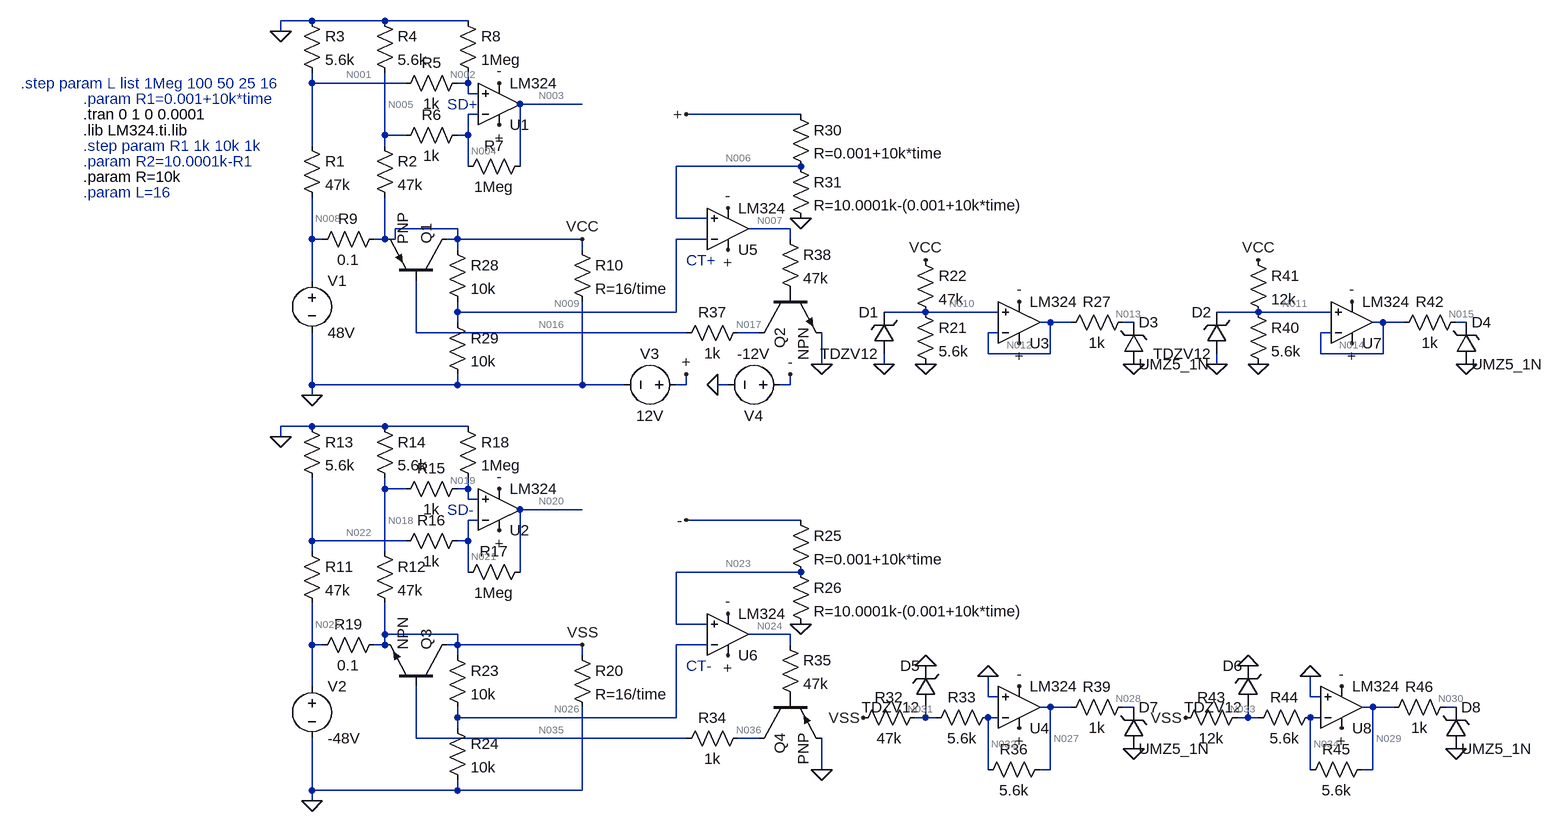
[diagram p0: schematic PSU_digital.asc]
PSU_digital.asc, the LTspice schematic file:
Version 4
SHEET 1 1804 1104
WIRE -96 -144 -144 -144
WIRE 16 -144 -96 -144
WIRE 144 -144 16 -144
WIRE -144 -128 -144 -144
WIRE -96 -48 -96 -64
WIRE 48 -48 -96 -48
WIRE 144 -48 144 -64
WIRE 144 -48 128 -48
WIRE 144 -32 144 -48
WIRE 160 -32 144 -32
WIRE 320 -16 224 -16
WIRE 160 0 144 0
WIRE 656 0 480 0
WIRE 16 32 16 -64
WIRE 48 32 16 32
WIRE 144 32 144 0
WIRE 144 32 128 32
WIRE -96 48 -96 -48
WIRE 16 48 16 32
WIRE 144 80 144 32
WIRE 224 80 224 -16
WIRE 656 80 464 80
WIRE 464 160 464 80
WIRE 512 160 464 160
WIRE 128 176 32 176
WIRE 640 176 576 176
WIRE -96 192 -96 128
WIRE -80 192 -96 192
WIRE 16 192 16 128
WIRE 16 192 0 192
WIRE 32 192 32 176
WIRE 32 192 16 192
WIRE 128 192 128 176
WIRE 128 192 112 192
WIRE 320 192 128 192
WIRE 512 192 464 192
WIRE 640 192 640 176
WIRE 128 208 128 192
WIRE 320 208 320 192
WIRE -96 256 -96 192
WIRE 128 304 128 288
WIRE 464 304 464 192
WIRE 464 304 128 304
WIRE 848 304 784 304
WIRE 960 304 848 304
WIRE 1360 304 1296 304
WIRE 1472 304 1360 304
WIRE 128 320 128 304
WIRE 1040 320 1024 320
WIRE 1072 320 1040 320
WIRE 1168 320 1152 320
WIRE 1552 320 1536 320
WIRE 1584 320 1552 320
WIRE 1680 320 1664 320
WIRE 64 336 64 256
WIRE 480 336 64 336
WIRE 592 336 560 336
WIRE 960 336 944 336
WIRE 1472 336 1456 336
WIRE 944 368 944 336
WIRE 1040 368 1040 320
WIRE 1040 368 944 368
WIRE 1456 368 1456 336
WIRE 1552 368 1552 320
WIRE 1552 368 1456 368
WIRE 688 384 688 336
WIRE 784 384 784 368
WIRE 1296 384 1296 368
WIRE -96 416 -96 336
WIRE 128 416 128 400
WIRE 128 416 -96 416
WIRE 320 416 320 288
WIRE 320 416 128 416
WIRE 384 416 320 416
WIRE 480 416 480 400
WIRE 480 416 464 416
WIRE 544 416 528 416
WIRE 640 416 640 400
WIRE 640 416 624 416
WIRE -96 432 -96 416
WIRE -96 480 -144 480
WIRE 16 480 -96 480
WIRE 144 480 16 480
WIRE -144 496 -144 480
WIRE 16 576 16 560
WIRE 48 576 16 576
WIRE 144 576 144 560
WIRE 144 576 128 576
WIRE 144 592 144 576
WIRE 160 592 144 592
WIRE 320 608 224 608
WIRE 160 624 144 624
WIRE 656 624 480 624
WIRE -96 656 -96 560
WIRE 48 656 -96 656
WIRE 144 656 144 624
WIRE 144 656 128 656
WIRE -96 672 -96 656
WIRE 16 672 16 576
WIRE 144 704 144 656
WIRE 224 704 224 608
WIRE 656 704 464 704
WIRE 464 784 464 704
WIRE 512 784 464 784
WIRE 16 800 16 752
WIRE 128 800 16 800
WIRE 640 800 576 800
WIRE -96 816 -96 752
WIRE -80 816 -96 816
WIRE 16 816 16 800
WIRE 16 816 0 816
WIRE 128 816 128 800
WIRE 128 816 112 816
WIRE 320 816 128 816
WIRE 512 816 464 816
WIRE 640 816 640 800
WIRE 128 832 128 816
WIRE 320 832 320 816
WIRE -96 880 -96 816
WIRE 944 896 944 864
WIRE 960 896 944 896
WIRE 1440 896 1440 864
WIRE 1456 896 1440 896
WIRE 1040 912 1024 912
WIRE 1072 912 1040 912
WIRE 1168 912 1152 912
WIRE 1536 912 1520 912
WIRE 1568 912 1536 912
WIRE 1664 912 1648 912
WIRE 128 928 128 912
WIRE 464 928 464 816
WIRE 464 928 128 928
WIRE 848 928 848 912
WIRE 848 928 832 928
WIRE 864 928 848 928
WIRE 960 928 944 928
WIRE 1344 928 1344 912
WIRE 1344 928 1328 928
WIRE 1360 928 1344 928
WIRE 1456 928 1440 928
WIRE 128 944 128 928
WIRE 64 960 64 880
WIRE 480 960 64 960
WIRE 592 960 560 960
WIRE 688 1008 688 960
WIRE 944 1008 944 928
WIRE 1040 1008 1040 912
WIRE 1040 1008 1024 1008
WIRE 1440 1008 1440 928
WIRE 1536 1008 1536 912
WIRE 1536 1008 1520 1008
WIRE -96 1040 -96 960
WIRE 128 1040 128 1024
WIRE 128 1040 -96 1040
WIRE 320 1040 320 912
WIRE 320 1040 128 1040
WIRE -96 1056 -96 1040
FLAG -144 -128 0
FLAG -96 432 0
FLAG 480 400 +
FLAG 544 208 +
FLAG 656 160 0
FLAG 192 16 +
FLAG 688 384 0
FLAG 640 400 -
FLAG 528 416 0
FLAG -144 496 0
FLAG -96 1056 0
FLAG 656 784 0
FLAG 688 1008 0
FLAG 192 576 -
FLAG 544 768 -
FLAG 192 640 +
FLAG 192 -48 -
FLAG 544 832 +
FLAG 544 144 -
FLAG 480 0 +
FLAG 480 624 -
FLAG 320 192 VCC
FLAG 320 816 VSS
FLAG 992 352 +
FLAG 992 288 -
FLAG 848 224 VCC
FLAG 848 384 0
FLAG 944 864 0
FLAG 992 880 -
FLAG 992 944 +
FLAG 752 928 VSS
FLAG 1504 352 +
FLAG 1504 288 -
FLAG 1360 224 VCC
FLAG 1360 384 0
FLAG 1440 864 0
FLAG 1488 880 -
FLAG 1488 944 +
FLAG 1248 928 VSS
FLAG 784 384 0
FLAG 1296 384 0
FLAG 1168 384 0
FLAG 1680 384 0
FLAG 848 848 0
FLAG 1344 848 0
FLAG 1168 976 0
FLAG 1664 976 0
SYMBOL res -112 32 R0
SYMATTR InstName R1
SYMATTR Value 47k
SYMBOL res 0 32 R0
SYMATTR InstName R2
SYMATTR Value 47k
SYMBOL res -112 -160 R0
SYMATTR InstName R3
SYMATTR Value 5.6k
SYMBOL res 0 -160 R0
SYMATTR InstName R4
SYMATTR Value 5.6k
SYMBOL res 144 -64 R90
WINDOW 0 0 56 VBottom 2
WINDOW 3 32 56 VTop 2
SYMATTR InstName R5
SYMATTR Value 1k
SYMBOL res 144 16 R90
WINDOW 0 0 56 VBottom 2
WINDOW 3 32 56 VTop 2
SYMATTR InstName R6
SYMATTR Value 1k
SYMBOL res 240 64 R90
WINDOW 0 0 56 VBottom 2
WINDOW 3 32 56 VTop 2
SYMATTR InstName R7
SYMATTR Value 1Meg
SYMBOL res 128 -160 R0
SYMATTR InstName R8
SYMATTR Value 1Meg
SYMBOL res 16 176 R90
WINDOW 0 0 56 VBottom 2
WINDOW 3 32 56 VTop 2
SYMATTR InstName R9
SYMATTR Value 0.1
SYMBOL res 304 192 R0
SYMATTR InstName R10
SYMATTR Value R=16/time
SYMBOL voltage 480 416 R90
WINDOW 0 -32 56 VBottom 2
WINDOW 3 32 56 VTop 2
WINDOW 123 0 0 Left 0
WINDOW 39 0 0 Left 0
SYMATTR InstName V3
SYMATTR Value 12V
SYMBOL res 112 192 R0
SYMATTR InstName R28
SYMATTR Value 10k
SYMBOL res 112 304 R0
SYMATTR InstName R29
SYMATTR Value 10k
SYMBOL res 640 -16 R0
SYMATTR InstName R30
SYMATTR Value R=0.001+10k*time
SYMBOL res 640 64 R0
SYMATTR InstName R31
SYMATTR Value R=10.0001k-(0.001+10k*time)
SYMBOL voltage -96 240 R0
WINDOW 123 0 0 Left 0
WINDOW 39 0 0 Left 0
SYMATTR InstName V1
SYMATTR Value 48V
SYMBOL OpAmps\\opamp2 192 48 M180
SYMATTR InstName U1
SYMATTR Value LM324
SYMBOL OpAmps\\opamp2 544 240 M180
SYMATTR InstName U5
SYMATTR Value LM324
SYMBOL npn 592 272 M90
SYMATTR InstName Q2
SYMBOL pnp 112 256 M270
SYMATTR InstName Q1
SYMBOL res 576 320 R90
WINDOW 0 0 56 VBottom 2
WINDOW 3 32 56 VTop 2
SYMATTR InstName R37
SYMATTR Value 1k
SYMBOL res 624 176 R0
SYMATTR InstName R38
SYMATTR Value 47k
SYMBOL voltage 640 416 R90
WINDOW 0 32 56 VTop 2
WINDOW 3 -32 56 VBottom 2
WINDOW 123 0 0 Left 0
WINDOW 39 0 0 Left 0
SYMATTR InstName V4
SYMATTR Value -12V
SYMBOL res -112 656 R0
SYMATTR InstName R11
SYMATTR Value 47k
SYMBOL res 0 656 R0
SYMATTR InstName R12
SYMATTR Value 47k
SYMBOL res -112 464 R0
SYMATTR InstName R13
SYMATTR Value 5.6k
SYMBOL res 0 464 R0
SYMATTR InstName R14
SYMATTR Value 5.6k
SYMBOL res 144 560 R90
WINDOW 0 0 56 VBottom 2
WINDOW 3 32 56 VTop 2
SYMATTR InstName R15
SYMATTR Value 1k
SYMBOL res 144 640 R90
WINDOW 0 0 56 VBottom 2
WINDOW 3 32 56 VTop 2
SYMATTR InstName R16
SYMATTR Value 1k
SYMBOL res 240 688 R90
WINDOW 0 0 56 VBottom 2
WINDOW 3 32 56 VTop 2
SYMATTR InstName R17
SYMATTR Value 1Meg
SYMBOL res 128 464 R0
SYMATTR InstName R18
SYMATTR Value 1Meg
SYMBOL res 16 800 R90
WINDOW 0 0 56 VBottom 2
WINDOW 3 32 56 VTop 2
SYMATTR InstName R19
SYMATTR Value 0.1
SYMBOL res 304 816 R0
SYMATTR InstName R20
SYMATTR Value R=16/time
SYMBOL res 112 816 R0
SYMATTR InstName R23
SYMATTR Value 10k
SYMBOL res 112 928 R0
SYMATTR InstName R24
SYMATTR Value 10k
SYMBOL res 640 608 R0
SYMATTR InstName R25
SYMATTR Value R=0.001+10k*time
SYMBOL res 640 688 R0
SYMATTR InstName R26
SYMATTR Value R=10.0001k-(0.001+10k*time)
SYMBOL OpAmps\\opamp2 192 672 M180
SYMATTR InstName U2
SYMATTR Value LM324
SYMBOL OpAmps\\opamp2 544 864 M180
SYMATTR InstName U6
SYMATTR Value LM324
SYMBOL res 576 944 R90
WINDOW 0 0 56 VBottom 2
WINDOW 3 32 56 VTop 2
SYMATTR InstName R34
SYMATTR Value 1k
SYMBOL res 624 800 R0
SYMATTR InstName R35
SYMATTR Value 47k
SYMBOL voltage -96 864 R0
WINDOW 123 0 0 Left 0
WINDOW 39 0 0 Left 0
SYMATTR InstName V2
SYMATTR Value -48V
SYMBOL npn 112 880 M270
SYMATTR InstName Q3
SYMBOL pnp 592 896 M90
SYMATTR InstName Q4
SYMBOL OpAmps\\opamp2 992 384 M180
SYMATTR InstName U3
SYMATTR Value LM324
SYMBOL res 832 288 R0
SYMATTR InstName R21
SYMATTR Value 5.6k
SYMBOL res 832 208 R0
SYMATTR InstName R22
SYMATTR Value 47k
SYMBOL res 1168 304 R90
WINDOW 0 0 56 VBottom 2
WINDOW 3 32 56 VTop 2
SYMATTR InstName R27
SYMATTR Value 1k
SYMBOL OpAmps\\opamp2 992 976 M180
SYMATTR InstName U4
SYMATTR Value LM324
SYMBOL res 848 912 R90
WINDOW 0 0 56 VBottom 2
WINDOW 3 32 56 VTop 2
SYMATTR InstName R32
SYMATTR Value 47k
SYMBOL res 960 912 R90
WINDOW 0 0 56 VBottom 2
WINDOW 3 32 56 VTop 2
SYMATTR InstName R33
SYMATTR Value 5.6k
SYMBOL res 1040 992 R90
WINDOW 0 0 56 VBottom 2
WINDOW 3 32 56 VTop 2
SYMATTR InstName R36
SYMATTR Value 5.6k
SYMBOL res 1168 896 R90
WINDOW 0 0 56 VBottom 2
WINDOW 3 32 56 VTop 2
SYMATTR InstName R39
SYMATTR Value 1k
SYMBOL OpAmps\\opamp2 1504 384 M180
SYMATTR InstName U7
SYMATTR Value LM324
SYMBOL res 1344 288 R0
SYMATTR InstName R40
SYMATTR Value 5.6k
SYMBOL res 1344 208 R0
SYMATTR InstName R41
SYMATTR Value 12k
SYMBOL res 1680 304 R90
WINDOW 0 0 56 VBottom 2
WINDOW 3 32 56 VTop 2
SYMATTR InstName R42
SYMATTR Value 1k
SYMBOL OpAmps\\opamp2 1488 976 M180
SYMATTR InstName U8
SYMATTR Value LM324
SYMBOL res 1344 912 R90
WINDOW 0 0 56 VBottom 2
WINDOW 3 32 56 VTop 2
SYMATTR InstName R43
SYMATTR Value 12k
SYMBOL res 1456 912 R90
WINDOW 0 0 56 VBottom 2
WINDOW 3 32 56 VTop 2
SYMATTR InstName R44
SYMATTR Value 5.6k
SYMBOL res 1536 992 R90
WINDOW 0 0 56 VBottom 2
WINDOW 3 32 56 VTop 2
SYMATTR InstName R45
SYMATTR Value 5.6k
SYMBOL res 1664 896 R90
WINDOW 0 0 56 VBottom 2
WINDOW 3 32 56 VTop 2
SYMATTR InstName R46
SYMATTR Value 1k
SYMBOL zener 800 368 R180
WINDOW 0 24 64 Left 2
WINDOW 3 24 0 Left 2
SYMATTR InstName D1
SYMATTR Value TDZV12
SYMBOL zener 1312 368 R180
WINDOW 0 24 64 Left 2
WINDOW 3 24 0 Left 2
SYMATTR InstName D2
SYMATTR Value TDZV12
SYMBOL zener 1152 384 M180
WINDOW 0 24 64 Left 2
WINDOW 3 24 0 Left 2
SYMATTR InstName D3
SYMATTR Value UMZ5_1N
SYMBOL zener 1664 384 M180
WINDOW 0 24 64 Left 2
WINDOW 3 24 0 Left 2
SYMATTR InstName D4
SYMATTR Value UMZ5_1N
SYMBOL zener 864 912 R180
WINDOW 0 24 64 Left 2
WINDOW 3 24 0 Left 2
SYMATTR InstName D5
SYMATTR Value TDZV12
SYMBOL zener 1360 912 R180
WINDOW 0 24 64 Left 2
WINDOW 3 24 0 Left 2
SYMATTR InstName D6
SYMATTR Value TDZV12
SYMBOL zener 1152 976 M180
WINDOW 0 24 64 Left 2
WINDOW 3 24 0 Left 2
SYMATTR InstName D7
SYMATTR Value UMZ5_1N
SYMBOL zener 1648 976 M180
WINDOW 0 24 64 Left 2
WINDOW 3 24 0 Left 2
SYMATTR InstName D8
SYMATTR Value UMZ5_1N
TEXT -448 0 Left 2 !.tran 0 1 0 0.0001
TEXT -448 24 Left 2 !.lib LM324.ti.lib
TEXT 112 -16 Left 2 ;SD+
TEXT 480 224 Left 2 ;CT+
TEXT -448 48 Left 2 ;.step param R1 1k 10k 1k
TEXT -448 96 Left 2 !.param R=10k
TEXT -544 -48 Left 2 ;.step param L list 1Meg 100 50 25 16
TEXT -448 72 Left 2 ;.param R2=10.0001k-R1
TEXT -448 -24 Left 2 ;.param R1=0.001+10k*time
TEXT -448 120 Left 2 ;.param L=16
TEXT 112 608 Left 2 ;SD-
TEXT 480 848 Left 2 ;CT-

The netlist it stands for:
* PSU_digital.asc
R1 N001 N008 47k
R2 N005 VCC 47k
R3 0 N001 5.6k
R4 0 N005 5.6k
R5 N002 N001 1k
R6 N004 N005 1k
R7 N003 N004 1Meg
R8 0 N002 1Meg
R9 VCC N008 0.1
R10 VCC 0 R=16/time
V3 + 0 12V
R28 VCC N009 10k
R29 N009 0 10k
R30 + N006 R=0.001+10k*time
R31 N006 0 R=10.0001k-(0.001+10k*time)
V1 N008 0 48V
XU1 N002 N004 + - N003 LM324  ; pins In+ In- V+ V- OUT
XU5 N006 N009 + - N007 LM324  ; pins In+ In- V+ V- OUT
Q2 N017 P001 0 0 NPN
Q1 VCC N016 VCC 0 PNP
R37 N017 N016 1k
R38 N007 P001 47k
V4 - 0 -12V
R11 N022 N025 47k
R12 N018 VSS 47k
R13 0 N022 5.6k
R14 0 N018 5.6k
R15 N019 N018 1k
R16 N021 N022 1k
R17 N020 N021 1Meg
R18 0 N019 1Meg
R19 VSS N025 0.1
R20 VSS 0 R=16/time
R23 VSS N026 10k
R24 N026 0 10k
R25 - N023 R=0.001+10k*time
R26 N023 0 R=10.0001k-(0.001+10k*time)
XU2 N019 N021 + - N020 LM324  ; pins In+ In- V+ V- OUT
XU6 N023 N026 + - N024 LM324  ; pins In+ In- V+ V- OUT
R34 N036 N035 1k
R35 N024 P002 47k
V2 N025 0 -48V
Q3 VSS N035 VSS 0 NPN
Q4 N036 P002 0 0 PNP
XU3 N010 N012 + - N012 LM324  ; pins In+ In- V+ V- OUT
R21 N010 0 5.6k
R22 VCC N010 47k
R27 N013 N012 1k
XU4 0 N032 + - N027 LM324  ; pins In+ In- V+ V- OUT
R32 N031 VSS 47k
R33 N032 N031 5.6k
R36 N027 N032 5.6k
R39 N028 N027 1k
XU7 N011 N014 + - N014 LM324  ; pins In+ In- V+ V- OUT
R40 N011 0 5.6k
R41 VCC N011 12k
R42 N015 N014 1k
XU8 0 N034 + - N029 LM324  ; pins In+ In- V+ V- OUT
R43 N033 VSS 12k
R44 N034 N033 5.6k
R45 N029 N034 5.6k
R46 N030 N029 1k
D1 0 N010 TDZV12
D2 0 N011 TDZV12
D3 0 N013 UMZ5_1N
D4 0 N015 UMZ5_1N
D5 N031 0 TDZV12
D6 N033 0 TDZV12
D7 0 N028 UMZ5_1N
D8 0 N030 UMZ5_1N
.model D D
.lib standard.dio
.model NPN NPN
.model PNP PNP
.lib standard.bjt
.tran 0 1 0 0.0001
.lib LM324.ti.lib
* SD+
* CT+
* .step param R1 1k 10k 1k
.param R=10k
* .step param L list 1Meg 100 50 25 16
* .param R2=10.0001k-R1
* .param R1=0.001+10k*time
* .param L=16
* SD-
* CT-
.backanno
.end

* Results of the author's LTspice run, read from the files saved beside the schematic
* Operating Point, zero values left out:
*   V(n001) = 5.085 V
*   V(n008) = 48 V
*   V(n005) = 5.085 V
*   V(vcc) = 48 V
*   V(n002) = 5.08 V
*   V(n004) = 5.08 V
*   V(n003) = -41.76 mV
*   V(+) = 12 V
*   V(n009) = 24 V
*   V(n006) = 12 V
*   V(-) = -12 V
*   V(n007) = -11.99 V
*   V(n017) = 47.66 V
*   V(p001) = -11.99 V
*   V(n016) = 47.66 V
*   V(n022) = -5.084 V
*   V(n025) = -48 V
*   V(n018) = -5.084 V
*   V(vss) = -48 V
*   V(n019) = -5.079 V
*   V(n021) = -5.079 V
*   V(n020) = 97.63 mV
*   V(n026) = -19.61 V
*   V(n023) = -12 V
*   V(n024) = -12.11 V
*   V(n036) = -23.2 V
*   V(n035) = -47.14 V
*   V(p002) = -856.4 mV
*   V(n012) = 5.11 V
*   V(n010) = 5.11 V
*   V(n013) = 4.923 V
*   V(n027) = 5.11 V
*   V(n032) = -86.08 µV
*   V(n031) = -5.11 V
*   V(n028) = 4.923 V
*   V(n014) = 10.49 V
*   V(n011) = 11.99 V
*   V(n015) = 5.092 V
*   V(n029) = 10.5 V
*   V(n034) = -749.4 mV
*   V(n033) = -11.99 V
*   V(n030) = 5.092 V
*   I(R10) = 48 pA
*   I(R30) = 1.2 mA
*   I(R31) = 1.2 mA
*   I(R20) = -48 pA
*   I(R25) = -1.2 mA
*   I(R26) = -1.2 mA
*   Ic(Q2) = 59.65 pA
*   Ib(Q2) = -71.64 pA
*   Ie(Q2) = 11.99 pA
*   Ic(Q3) = -23.71 mA
*   Ib(Q3) = 23.95 mA
*   Ie(Q3) = -237.1 µA
*   Ic(Q1) = 58.72 pA
*   Ib(Q1) = -59.65 pA
*   Ic(Q4) = -23.95 mA
*   Ib(Q4) = -239.5 µA
*   Ie(Q4) = 24.19 mA
*   I(D1) = -11.22 pA
*   I(D2) = -858.7 µA
*   I(D5) = -11.22 pA
*   I(D6) = -992.2 µA
*   I(D3) = -187 µA
*   I(D4) = -5.402 mA
*   I(D7) = -186.9 µA
*   I(D8) = -5.404 mA
*   I(R1) = -913.1 µA
*   I(R2) = -913.1 µA
*   I(R3) = -908 µA
*   I(R4) = -908 µA
*   I(R5) = -5.061 µA
*   I(R6) = -5.102 µA
*   I(R7) = -5.121 µA
*   I(R8) = -5.08 µA
*   I(R9) = -7.227 mA
*   I(R28) = 2.4 mA
*   I(R29) = 2.4 mA
*   I(R37) = -59.65 pA
*   I(R38) = -71.64 pA
*   I(R11) = 913.1 µA
*   I(R12) = 913 µA
*   I(R13) = 907.9 µA
*   I(R14) = 907.9 µA
*   I(R15) = 5.1 µA
*   I(R16) = 5.197 µA
*   I(R17) = 5.177 µA
*   I(R18) = 5.079 µA
*   I(R19) = 31.61 mA
*   I(R23) = -2.839 mA
*   I(R24) = -1.961 mA
*   I(R34) = 23.95 mA
*   I(R35) = -239.5 µA
*   I(R21) = 912.6 µA
*   I(R22) = 912.5 µA
*   I(R27) = -187 µA
*   I(R32) = 912.5 µA
*   I(R33) = 912.5 µA
*   I(R36) = 912.5 µA
*   I(R39) = -186.9 µA
*   I(R40) = 2.142 mA
*   I(R41) = 3 mA
*   I(R42) = -5.402 mA
*   I(R43) = 3 mA
*   I(R44) = 2.008 mA
*   I(R45) = 2.008 mA
*   I(R46) = -5.404 mA
*   I(V3) = -7.599 mA
*   I(V1) = -8.14 mA
*   I(V4) = 6.04 mA
*   I(V2) = 32.52 mA
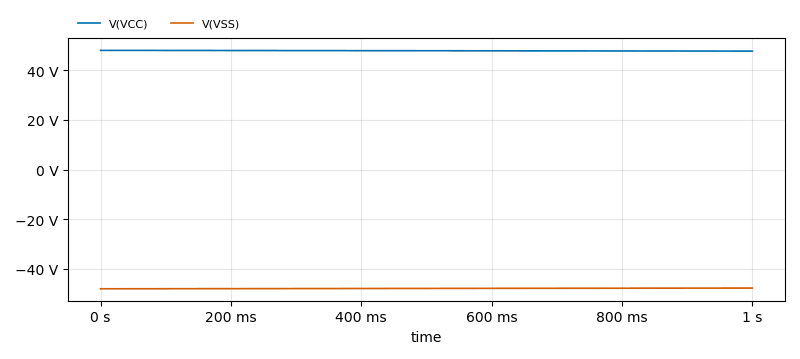
[diagram p1: Transient Analysis of PSU_digital.asc, plotted from the saved traces]
* Transient Analysis, 1 run:
*   V(VCC): min 47.7 V, max 48 V, average 47.85 V, rms 47.85 V, last 47.7 V
*   V(VSS): min -48 V, max -47.7 V, average -47.85 V, rms 47.85 V, last -47.7 V